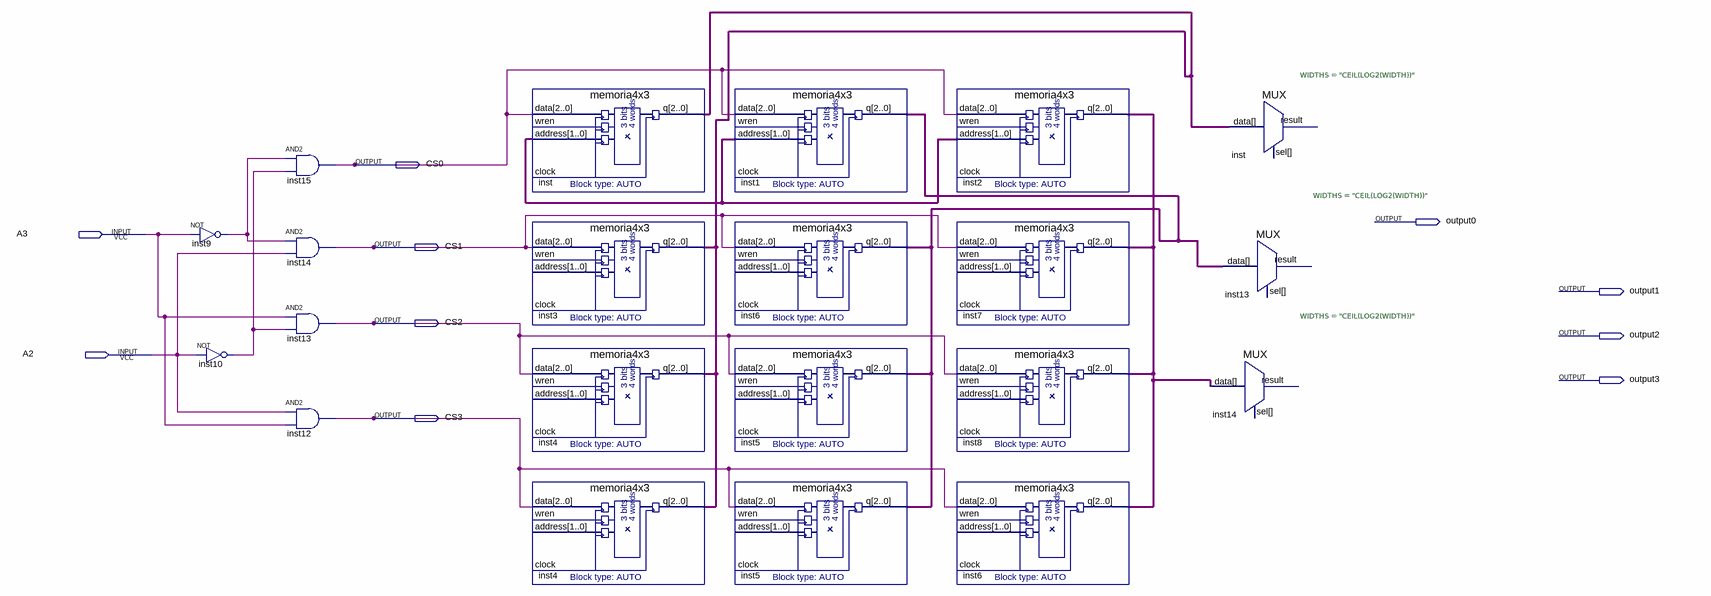
[diagram p0: schematic sheet]
// Quartus schematic memoria16x9.bdf as structural Verilog: 21 symbols, 10 pins
module memoria16x9 (
  input  A3,
  input  A2,
  output CS0,
  output output0,
  output CS1,
  output output1,
  output CS2,
  output output2,
  output output3,
  output CS3
);

  wire inst9_out, inst10_out;
  wire [1:0] undriven;
  wire [2:0] inst1_q, inst2_q, inst_q;

  not inst9 (inst9_out, A3);
  not inst10 (inst10_out, A2);
  and inst15 (CS0, inst9_out, inst10_out);
  and inst14 (CS1, inst9_out, A2);
  and inst13 (CS2, A3, inst10_out);
  and inst12 (CS3, A2, A3);
  memoria4x3 inst (.data({3{CS0}}), .address(undriven), .q(inst_q));  // open: wren, clock
  memoria4x3 inst3 (.data({3{CS1}}), .q(inst_q));  // open: wren, address, clock
  memoria4x3 inst4 (.data({3{CS2}}), .q(inst_q));  // open: wren, address, clock
  memoria4x3 inst4_dup2 (.data({3{CS3}}), .q(inst_q));  // open: wren, address, clock
  memoria4x3 inst1 (.data({3{CS0}}), .address(undriven), .q(inst1_q));  // open: wren, clock
  memoria4x3 inst6 (.data({3{CS1}}), .q(inst1_q));  // open: wren, address, clock
  memoria4x3 inst5 (.data({3{CS2}}), .q(inst1_q));  // open: wren, address, clock
  memoria4x3 inst5_dup2 (.data({3{CS3}}), .q(inst1_q));  // open: wren, address, clock
  memoria4x3 inst2 (.data({3{CS0}}), .address(undriven), .q(inst2_q));  // open: wren, clock
  memoria4x3 inst7 (.data({3{CS1}}), .q(inst2_q));  // open: wren, address, clock
  memoria4x3 inst8 (.data({3{CS2}}), .q(inst2_q));  // open: wren, address, clock
  memoria4x3 inst6_dup2 (.data({3{CS3}}), .q(inst2_q));  // open: wren, address, clock
  MUX #(.WIDTHS("CEIL(LOG2(WIDTH))")) inst14_dup2 (.data(inst2_q));  // open: sel, result
  MUX #(.WIDTHS("CEIL(LOG2(WIDTH))")) inst_dup2 (.data(inst_q));  // open: sel, result
  MUX #(.WIDTHS("CEIL(LOG2(WIDTH))")) inst13_dup2 (.data(inst1_q));  // open: sel, result
endmodule
